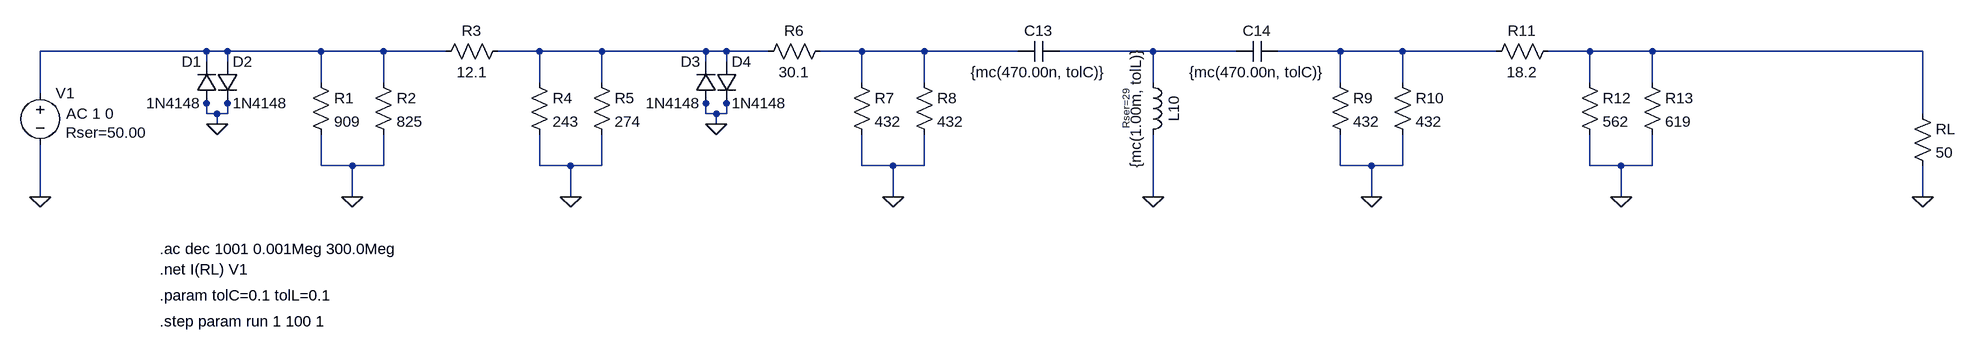
[diagram p0: schematic 10dBAttenuator_TransientLimiter.asc]
10dBAttenuator_TransientLimiter.asc, the LTspice schematic file:
Version 4
SHEET 1 2660 836
WIRE -336 -176 -592 -176
WIRE -304 -176 -336 -176
WIRE -160 -176 -304 -176
WIRE -64 -176 -160 -176
WIRE 32 -176 -64 -176
WIRE 176 -176 112 -176
WIRE 272 -176 176 -176
WIRE 432 -176 272 -176
WIRE 464 -176 432 -176
WIRE 528 -176 464 -176
WIRE 672 -176 608 -176
WIRE 768 -176 672 -176
WIRE 912 -176 768 -176
WIRE 1120 -176 976 -176
WIRE 1248 -176 1120 -176
WIRE 1408 -176 1312 -176
WIRE 1504 -176 1408 -176
WIRE 1648 -176 1504 -176
WIRE 1792 -176 1728 -176
WIRE 1888 -176 1792 -176
WIRE 2304 -176 1888 -176
WIRE -336 -160 -336 -176
WIRE -304 -160 -304 -176
WIRE 432 -160 432 -176
WIRE 464 -160 464 -176
WIRE -160 -128 -160 -176
WIRE -64 -128 -64 -176
WIRE 176 -128 176 -176
WIRE 272 -128 272 -176
WIRE 672 -128 672 -176
WIRE 768 -128 768 -176
WIRE 1120 -128 1120 -176
WIRE 1408 -128 1408 -176
WIRE 1504 -128 1504 -176
WIRE 1792 -128 1792 -176
WIRE 1888 -128 1888 -176
WIRE -592 -112 -592 -176
WIRE -336 -96 -336 -112
WIRE -304 -96 -304 -112
WIRE 432 -96 432 -112
WIRE 464 -96 464 -112
WIRE -336 -80 -336 -96
WIRE -320 -80 -336 -80
WIRE -304 -80 -304 -96
WIRE -304 -80 -320 -80
WIRE 432 -80 432 -96
WIRE 448 -80 432 -80
WIRE 464 -80 464 -96
WIRE 464 -80 448 -80
WIRE 2304 -80 2304 -176
WIRE -320 -64 -320 -80
WIRE 448 -64 448 -80
WIRE -160 0 -160 -48
WIRE -112 0 -160 0
WIRE -64 0 -64 -48
WIRE -64 0 -112 0
WIRE 176 0 176 -48
WIRE 224 0 176 0
WIRE 272 0 272 -48
WIRE 272 0 224 0
WIRE 672 0 672 -48
WIRE 720 0 672 0
WIRE 768 0 768 -48
WIRE 768 0 720 0
WIRE 1408 0 1408 -48
WIRE 1456 0 1408 0
WIRE 1504 0 1504 -48
WIRE 1504 0 1456 0
WIRE 1792 0 1792 -48
WIRE 1840 0 1792 0
WIRE 1888 0 1888 -48
WIRE 1888 0 1840 0
WIRE -592 48 -592 -32
WIRE -112 48 -112 0
WIRE 224 48 224 0
WIRE 720 48 720 0
WIRE 1120 48 1120 -48
WIRE 1456 48 1456 0
WIRE 1840 48 1840 0
WIRE 2304 48 2304 0
FLAG -592 48 0
FLAG 2304 48 0
FLAG -112 48 0
FLAG 224 48 0
FLAG 720 48 0
FLAG 1120 48 0
FLAG 1456 48 0
FLAG 1840 48 0
FLAG -320 -64 0
FLAG 448 -64 0
SYMBOL voltage -592 -128 R0
WINDOW 123 40 48 Left 2
WINDOW 39 39 77 Left 2
SYMATTR Value2 AC 1 0
SYMATTR SpiceLine Rser=50.00
SYMATTR InstName V1
SYMATTR Value ""
SYMBOL res 2288 -96 R0
SYMATTR InstName RL
SYMATTR Value 50
SYMBOL res -176 -144 R0
SYMATTR InstName R1
SYMATTR Value 909
SYMATTR SpiceLine tol=1
SYMBOL res -80 -144 R0
SYMATTR InstName R2
SYMATTR Value 825
SYMATTR SpiceLine tol=1
SYMBOL res 128 -192 R90
WINDOW 0 0 56 VBottom 2
WINDOW 3 32 56 VTop 2
SYMATTR InstName R3
SYMATTR Value 12.1
SYMATTR SpiceLine tol=1
SYMBOL res 160 -144 R0
SYMATTR InstName R4
SYMATTR Value 243
SYMATTR SpiceLine tol=1
SYMBOL res 256 -144 R0
SYMATTR InstName R5
SYMATTR Value 274
SYMATTR SpiceLine tol=1
SYMBOL res 624 -192 R90
WINDOW 0 0 56 VBottom 2
WINDOW 3 32 56 VTop 2
SYMATTR InstName R6
SYMATTR Value 30.1
SYMATTR SpiceLine tol=1
SYMBOL res 656 -144 R0
SYMATTR InstName R7
SYMATTR Value 432
SYMATTR SpiceLine tol=1
SYMBOL res 752 -144 R0
SYMATTR InstName R8
SYMATTR Value 432
SYMATTR SpiceLine tol=1
SYMBOL cap 912 -160 R270
WINDOW 0 32 32 VTop 2
WINDOW 3 0 32 VBottom 2
SYMATTR InstName C13
SYMATTR Value {mc(470.00n, tolC)}
SYMBOL ind 1104 -144 R0
WINDOW 0 32 56 VTop 2
WINDOW 3 5 56 VBottom 2
WINDOW 39 -36 57 VTop 1
SYMATTR InstName L10
SYMATTR Value {mc(1.00m, tolL)}
SYMATTR SpiceLine Rser=29
SYMBOL cap 1248 -160 R270
WINDOW 0 32 32 VTop 2
WINDOW 3 0 32 VBottom 2
SYMATTR InstName C14
SYMATTR Value {mc(470.00n, tolC)}
SYMBOL res 1392 -144 R0
SYMATTR InstName R9
SYMATTR Value 432
SYMATTR SpiceLine tol=1
SYMBOL res 1488 -144 R0
SYMATTR InstName R10
SYMATTR Value 432
SYMATTR SpiceLine tol=1
SYMBOL res 1744 -192 R90
WINDOW 0 0 56 VBottom 2
WINDOW 3 32 56 VTop 2
SYMATTR InstName R11
SYMATTR Value 18.2
SYMATTR SpiceLine tol=1
SYMBOL res 1776 -144 R0
SYMATTR InstName R12
SYMATTR Value 562
SYMATTR SpiceLine tol=1
SYMBOL res 1872 -144 R0
SYMATTR InstName R13
SYMATTR Value 619
SYMATTR SpiceLine tol=1
SYMBOL diode -320 -96 R180
WINDOW 0 24 64 Left 2
WINDOW 3 24 0 Left 2
SYMATTR InstName D1
SYMATTR Value 1N4148
SYMBOL diode -320 -160 R0
SYMATTR InstName D2
SYMATTR Value 1N4148
SYMBOL diode 448 -96 R180
WINDOW 0 24 64 Left 2
WINDOW 3 24 0 Left 2
SYMATTR InstName D3
SYMATTR Value 1N4148
SYMBOL diode 448 -160 R0
SYMATTR InstName D4
SYMATTR Value 1N4148
TEXT -408 128 Left 2 !.ac dec 1001 0.001Meg 300.0Meg
TEXT -408 160 Left 2 !.net I(RL) V1
TEXT -408 200 Left 2 !.param tolC=0.1 tolL=0.1
TEXT -408 240 Left 2 !.step param run 1 100 1

The netlist it stands for:
* 10dBAttenuator_TransientLimiter.asc
V1 N001 0 AC 1 0 Rser=50.00
RL N006 0 50
R1 N001 0 909 tol=1
R2 N001 0 825 tol=1
R3 N002 N001 12.1 tol=1
R4 N002 0 243 tol=1
R5 N002 0 274 tol=1
R6 N003 N002 30.1 tol=1
R7 N003 0 432 tol=1
R8 N003 0 432 tol=1
C13 N003 N004 {mc(470.00n, tolC)}
L10 N004 0 {mc(1.00m, tolL)} Rser=29
C14 N004 N005 {mc(470.00n, tolC)}
R9 N005 0 432 tol=1
R10 N005 0 432 tol=1
R11 N006 N005 18.2 tol=1
R12 N006 0 562 tol=1
R13 N006 0 619 tol=1
D1 0 N001 1N4148
D2 N001 0 1N4148
D3 0 N002 1N4148
D4 N002 0 1N4148
.model D D
.lib standard.dio
.ac dec 1001 0.001Meg 300.0Meg
.net I(RL) V1
.param tolC=0.1 tolL=0.1
.step param run 1 100 1
.backanno
.end